# Altium schematic sheet buzzer.SchDoc
size A4; Engineer: Amir Hossein Jobeiri; Organization: Simaran; SheetNumber: 13; SheetTotal: 24
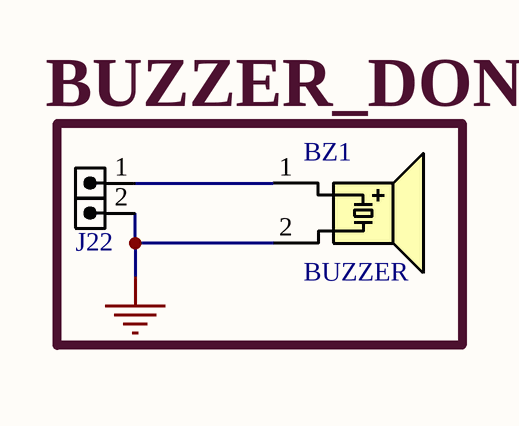
[diagram p0: buzzer.SchDoc]

## Parts
BZ1  BUZZER  [BZ_C9]
J22  HDRM2  [HDR_M_1X2]  (value not drawn)

## Nets
GND: BZ1.2(B) J22.2
NetBZ1_1: BZ1.1(A) J22.1

## Notes on the sheet
- BUZZER_DONE

## Library data of the parts
BZ1 = BUZZER_C9: Buzzer, 9mm, Magnetic Transducer; MANF: Mallory; MANF_P#: PB-09N23P-03Q; PARAM2: 3V, 30mA; PARAM: 2.7KHz; PRICE: $3; VALUE: BUZZER
J22 = HDR_M_1X2: CONN, HEADER, Male, pitch: 2.54mm, 2POS; VALUE: HDRM2